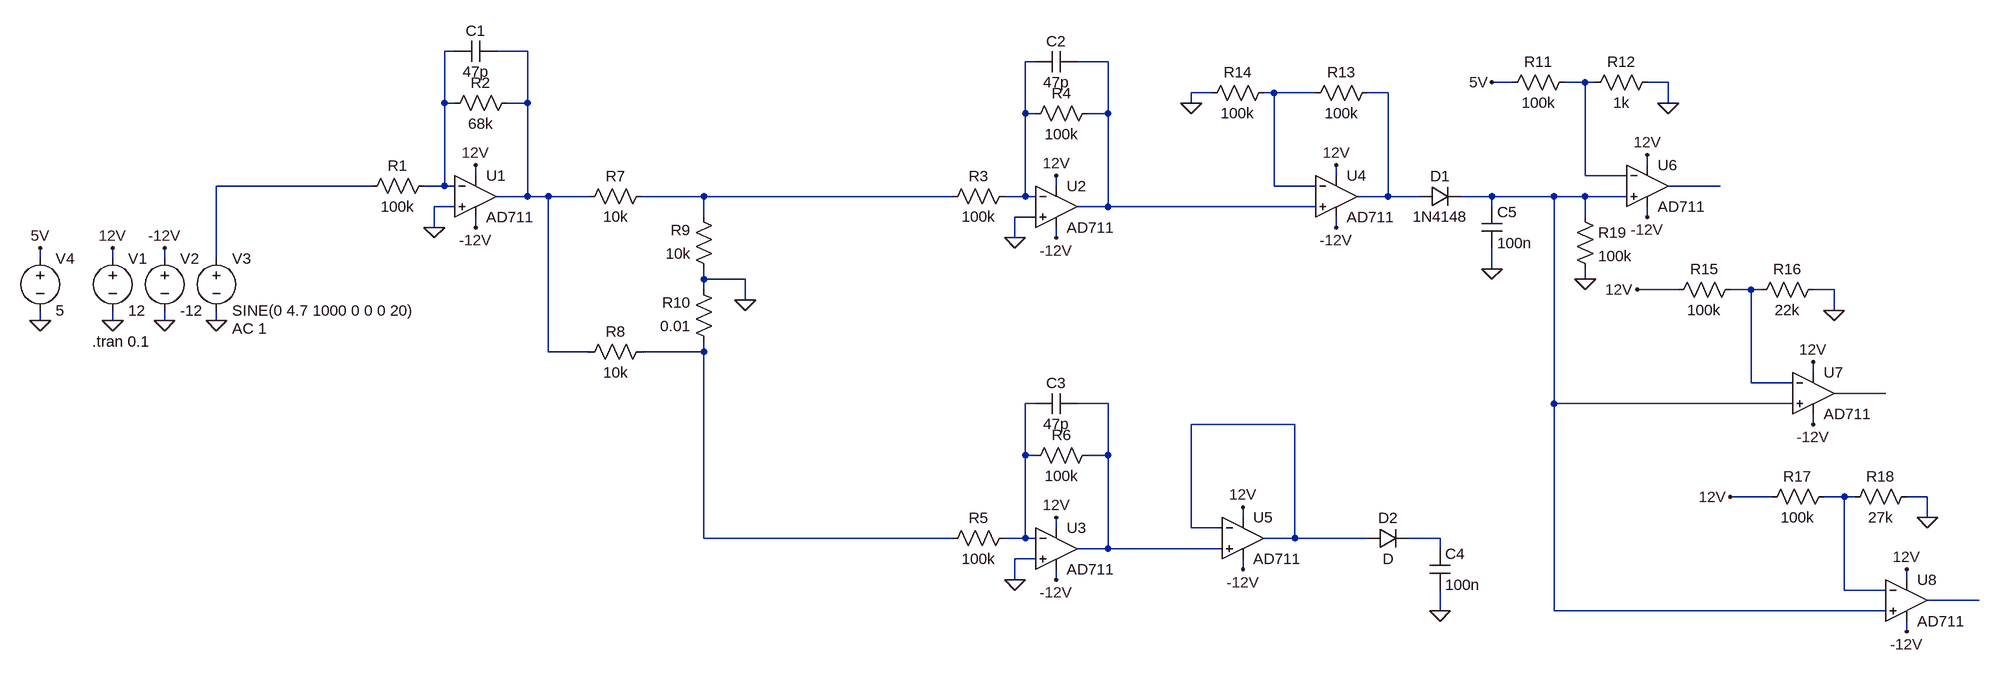
[diagram p0: schematic panning mix.asc]
panning mix.asc, the LTspice schematic file:
Version 4
SHEET 1 2516 900
WIRE 160 -96 144 -96
WIRE 272 -96 224 -96
WIRE 1056 -80 1040 -80
WIRE 1168 -80 1120 -80
WIRE 1792 -48 1760 -48
WIRE 1904 -48 1872 -48
WIRE 1920 -48 1904 -48
WIRE 2032 -48 2000 -48
WIRE 1328 -32 1296 -32
WIRE 1424 -32 1408 -32
WIRE 1488 -32 1424 -32
WIRE 1600 -32 1568 -32
WIRE 144 -16 144 -96
WIRE 160 -16 144 -16
WIRE 272 -16 272 -96
WIRE 272 -16 240 -16
WIRE 1296 -16 1296 -32
WIRE 2032 -16 2032 -48
WIRE 1040 0 1040 -80
WIRE 1056 0 1040 0
WIRE 1168 0 1168 -80
WIRE 1168 0 1136 0
WIRE 2000 80 2000 64
WIRE 192 96 192 80
WIRE 1520 96 1520 80
WIRE 1904 96 1904 -48
WIRE 1968 96 1904 96
WIRE 32 112 -208 112
WIRE 144 112 144 -16
WIRE 144 112 112 112
WIRE 160 112 144 112
WIRE 1088 112 1088 96
WIRE 1424 112 1424 -32
WIRE 1488 112 1424 112
WIRE 2112 112 2032 112
WIRE 272 128 272 -16
WIRE 272 128 224 128
WIRE 304 128 272 128
WIRE 368 128 304 128
WIRE 544 128 448 128
WIRE 928 128 544 128
WIRE 1040 128 1040 0
WIRE 1040 128 1008 128
WIRE 1056 128 1040 128
WIRE 1600 128 1600 -32
WIRE 1600 128 1552 128
WIRE 1648 128 1600 128
WIRE 1760 128 1712 128
WIRE 1856 128 1760 128
WIRE 1904 128 1856 128
WIRE 1968 128 1904 128
WIRE 160 144 128 144
WIRE 1168 144 1168 0
WIRE 1168 144 1120 144
WIRE 1488 144 1168 144
WIRE 1760 144 1760 128
WIRE 544 160 544 128
WIRE 1056 160 1024 160
WIRE 1904 160 1904 128
WIRE 2000 160 2000 144
WIRE 128 176 128 144
WIRE 192 176 192 160
WIRE 1520 176 1520 160
WIRE 1024 192 1024 160
WIRE 1088 192 1088 176
WIRE -480 224 -480 208
WIRE -368 224 -368 208
WIRE -288 224 -288 208
WIRE -208 224 -208 112
WIRE 1760 240 1760 208
WIRE 544 256 544 240
WIRE 608 256 544 256
WIRE 1904 256 1904 240
WIRE 544 272 544 256
WIRE 2048 272 1984 272
WIRE 2160 272 2128 272
WIRE 2176 272 2160 272
WIRE 2288 272 2256 272
WIRE 608 288 608 256
WIRE 2288 304 2288 272
WIRE -480 320 -480 304
WIRE -368 320 -368 304
WIRE -288 320 -288 304
WIRE -208 320 -208 304
WIRE 304 368 304 128
WIRE 368 368 304 368
WIRE 544 368 544 352
WIRE 544 368 448 368
WIRE 2256 400 2256 384
WIRE 2160 416 2160 272
WIRE 2224 416 2160 416
WIRE 2368 432 2288 432
WIRE 1056 448 1040 448
WIRE 1168 448 1120 448
WIRE 1856 448 1856 128
WIRE 2224 448 1856 448
WIRE 1456 480 1296 480
WIRE 2256 480 2256 464
WIRE 1040 528 1040 448
WIRE 1056 528 1040 528
WIRE 1168 528 1168 448
WIRE 1168 528 1136 528
WIRE 2192 592 2128 592
WIRE 2304 592 2272 592
WIRE 2320 592 2304 592
WIRE 2432 592 2400 592
WIRE 1376 624 1376 608
WIRE 2432 624 2432 592
WIRE 1088 640 1088 624
WIRE 1296 640 1296 480
WIRE 1344 640 1296 640
WIRE 544 656 544 368
WIRE 928 656 544 656
WIRE 1040 656 1040 528
WIRE 1040 656 1008 656
WIRE 1056 656 1040 656
WIRE 1456 656 1456 480
WIRE 1456 656 1408 656
WIRE 1568 656 1456 656
WIRE 1680 656 1632 656
WIRE 1168 672 1168 528
WIRE 1168 672 1120 672
WIRE 1344 672 1168 672
WIRE 1680 672 1680 656
WIRE 1056 688 1024 688
WIRE 1376 704 1376 688
WIRE 1024 720 1024 688
WIRE 1088 720 1088 704
WIRE 2400 720 2400 704
WIRE 2304 736 2304 592
WIRE 2368 736 2304 736
WIRE 2512 752 2432 752
WIRE 1680 768 1680 736
WIRE 1856 768 1856 448
WIRE 2368 768 1856 768
WIRE 2400 800 2400 784
FLAG -368 320 0
FLAG -288 320 0
FLAG -208 320 0
FLAG -368 208 12V
FLAG 192 80 12V
FLAG -288 208 -12V
FLAG 192 176 -12V
FLAG 128 176 0
FLAG 608 288 0
FLAG 1088 96 12V
FLAG 1088 192 -12V
FLAG 1024 192 0
FLAG 1088 624 12V
FLAG 1088 720 -12V
FLAG 1024 720 0
FLAG 1520 80 12V
FLAG 1520 176 -12V
FLAG -480 320 0
FLAG -480 208 5V
FLAG 1680 768 0
FLAG 1376 608 12V
FLAG 1376 704 -12V
FLAG 1760 240 0
FLAG 2000 64 12V
FLAG 2000 160 -12V
FLAG 2032 -16 0
FLAG 1760 -48 5V
FLAG 1296 -16 0
FLAG 2256 384 12V
FLAG 2256 480 -12V
FLAG 2288 304 0
FLAG 1984 272 12V
FLAG 2400 704 12V
FLAG 2400 800 -12V
FLAG 2432 624 0
FLAG 2128 592 12V
FLAG 1904 256 0
SYMBOL OpAmps\\AD711 192 64 R0
SYMATTR InstName U1
SYMBOL voltage -368 208 R0
WINDOW 123 0 0 Left 0
WINDOW 39 0 0 Left 0
SYMATTR InstName V1
SYMATTR Value 12
SYMBOL voltage -288 208 R0
WINDOW 123 0 0 Left 0
WINDOW 39 0 0 Left 0
SYMATTR InstName V2
SYMATTR Value -12
SYMBOL voltage -208 208 R0
WINDOW 123 24 124 Left 2
WINDOW 39 0 0 Left 0
SYMATTR Value2 AC 1
SYMATTR InstName V3
SYMATTR Value SINE(0 4.7 1000 0 0 0 20)
SYMBOL res 128 96 R90
WINDOW 0 0 56 VBottom 2
WINDOW 3 32 56 VTop 2
SYMATTR InstName R1
SYMATTR Value 100k
SYMBOL res 256 -32 R90
WINDOW 0 0 56 VBottom 2
WINDOW 3 32 56 VTop 2
SYMATTR InstName R2
SYMATTR Value 68k
SYMBOL cap 224 -112 R90
WINDOW 0 0 32 VBottom 2
WINDOW 3 32 32 VTop 2
SYMATTR InstName C1
SYMATTR Value 47p
SYMBOL res 464 112 R90
WINDOW 0 0 56 VBottom 2
WINDOW 3 32 56 VTop 2
SYMATTR InstName R7
SYMATTR Value 10k
SYMBOL res 464 352 R90
WINDOW 0 0 56 VBottom 2
WINDOW 3 32 56 VTop 2
SYMATTR InstName R8
SYMATTR Value 10k
SYMBOL res 560 256 R180
WINDOW 0 36 76 Left 2
WINDOW 3 36 40 Left 2
SYMATTR InstName R9
SYMATTR Value 10k
SYMBOL res 560 368 R180
WINDOW 0 36 76 Left 2
WINDOW 3 36 40 Left 2
SYMATTR InstName R10
SYMATTR Value 0.01
SYMBOL OpAmps\\AD711 1088 80 R0
SYMATTR InstName U2
SYMBOL res 1024 112 R90
WINDOW 0 0 56 VBottom 2
WINDOW 3 32 56 VTop 2
SYMATTR InstName R3
SYMATTR Value 100k
SYMBOL res 1152 -16 R90
WINDOW 0 0 56 VBottom 2
WINDOW 3 32 56 VTop 2
SYMATTR InstName R4
SYMATTR Value 100k
SYMBOL cap 1120 -96 R90
WINDOW 0 0 32 VBottom 2
WINDOW 3 32 32 VTop 2
SYMATTR InstName C2
SYMATTR Value 47p
SYMBOL OpAmps\\AD711 1088 608 R0
SYMATTR InstName U3
SYMBOL res 1024 640 R90
WINDOW 0 0 56 VBottom 2
WINDOW 3 32 56 VTop 2
SYMATTR InstName R5
SYMATTR Value 100k
SYMBOL res 1152 512 R90
WINDOW 0 0 56 VBottom 2
WINDOW 3 32 56 VTop 2
SYMATTR InstName R6
SYMATTR Value 100k
SYMBOL cap 1120 432 R90
WINDOW 0 0 32 VBottom 2
WINDOW 3 32 32 VTop 2
SYMATTR InstName C3
SYMATTR Value 47p
SYMBOL OpAmps\\AD711 1520 64 R0
SYMATTR InstName U4
SYMBOL voltage -480 208 R0
WINDOW 123 0 0 Left 0
WINDOW 39 0 0 Left 0
SYMATTR InstName V4
SYMATTR Value 5
SYMBOL diode 1568 672 R270
WINDOW 0 32 32 VTop 2
WINDOW 3 0 32 VBottom 2
SYMATTR InstName D2
SYMBOL cap 1664 672 R0
SYMATTR InstName C4
SYMATTR Value 100n
SYMBOL OpAmps\\AD711 1376 592 R0
SYMATTR InstName U5
SYMBOL cap 1744 144 R0
SYMATTR InstName C5
SYMATTR Value 100n
SYMBOL OpAmps\\AD711 2000 48 R0
SYMATTR InstName U6
SYMBOL res 1888 -64 R90
WINDOW 0 0 56 VBottom 2
WINDOW 3 32 56 VTop 2
SYMATTR InstName R11
SYMATTR Value 100k
SYMBOL res 2016 -64 R90
WINDOW 0 0 56 VBottom 2
WINDOW 3 32 56 VTop 2
SYMATTR InstName R12
SYMATTR Value 1k
SYMBOL res 1584 -48 R90
WINDOW 0 0 56 VBottom 2
WINDOW 3 32 56 VTop 2
SYMATTR InstName R13
SYMATTR Value 100k
SYMBOL res 1424 -48 R90
WINDOW 0 0 56 VBottom 2
WINDOW 3 32 56 VTop 2
SYMATTR InstName R14
SYMATTR Value 100k
SYMBOL OpAmps\\AD711 2256 368 R0
SYMATTR InstName U7
SYMBOL res 2144 256 R90
WINDOW 0 0 56 VBottom 2
WINDOW 3 32 56 VTop 2
SYMATTR InstName R15
SYMATTR Value 100k
SYMBOL res 2272 256 R90
WINDOW 0 0 56 VBottom 2
WINDOW 3 32 56 VTop 2
SYMATTR InstName R16
SYMATTR Value 22k
SYMBOL OpAmps\\AD711 2400 688 R0
SYMATTR InstName U8
SYMBOL res 2288 576 R90
WINDOW 0 0 56 VBottom 2
WINDOW 3 32 56 VTop 2
SYMATTR InstName R17
SYMATTR Value 100k
SYMBOL res 2416 576 R90
WINDOW 0 0 56 VBottom 2
WINDOW 3 32 56 VTop 2
SYMATTR InstName R18
SYMATTR Value 27k
SYMBOL res 1888 144 R0
SYMATTR InstName R19
SYMATTR Value 100k
SYMBOL diode 1648 144 R270
WINDOW 0 32 32 VTop 2
WINDOW 3 0 32 VBottom 2
SYMATTR InstName D1
SYMATTR Value 1N4148
TEXT -400 352 Left 2 !.tran 0.1

The netlist it stands for:
* panning mix.asc
XU1 0 N001 12V -12V N002 AD712  ; AD711, pins In+ In- V+ V- OUT
V1 12V 0 12
V2 -12V 0 -12
V3 N008 0 SINE(0 4.7 1000 0 0 0 20) AC 1
R1 N001 N008 100k
R2 N002 N001 68k
C1 N002 N001 47p
R7 N010 N002 10k
R8 N013 N002 10k
R9 0 N010 10k
R10 N013 0 0.01
XU2 0 N003 12V -12V N004 AD712  ; AD711, pins In+ In- V+ V- OUT
R3 N003 N010 100k
R4 N004 N003 100k
C2 N004 N003 47p
XU3 0 N015 12V -12V N016 AD712  ; AD711, pins In+ In- V+ V- OUT
R5 N015 N013 100k
R6 N016 N015 100k
C3 N016 N015 47p
XU4 N004 N006 12V -12V N007 AD712  ; AD711, pins In+ In- V+ V- OUT
V4 5V 0 5
D2 N017 N019 D
C4 N019 0 100n
XU5 N016 N017 12V -12V N017 AD712  ; AD711, pins In+ In- V+ V- OUT
C5 N011 0 100n
XU6 N011 N005 12V -12V N009 AD712  ; AD711, pins In+ In- V+ V- OUT
R11 N005 5V 100k
R12 0 N005 1k
R13 N007 N006 100k
R14 N006 0 100k
XU7 N011 N012 12V -12V N014 AD712  ; AD711, pins In+ In- V+ V- OUT
R15 N012 12V 100k
R16 0 N012 22k
XU8 N011 N018 12V -12V N020 AD712  ; AD711, pins In+ In- V+ V- OUT
R17 N018 12V 100k
R18 0 N018 27k
R19 N011 0 100k
D1 N007 N011 1N4148
.model D D
.lib standard.dio
.tran 0.1
.lib ADI1.lib
.backanno
.end